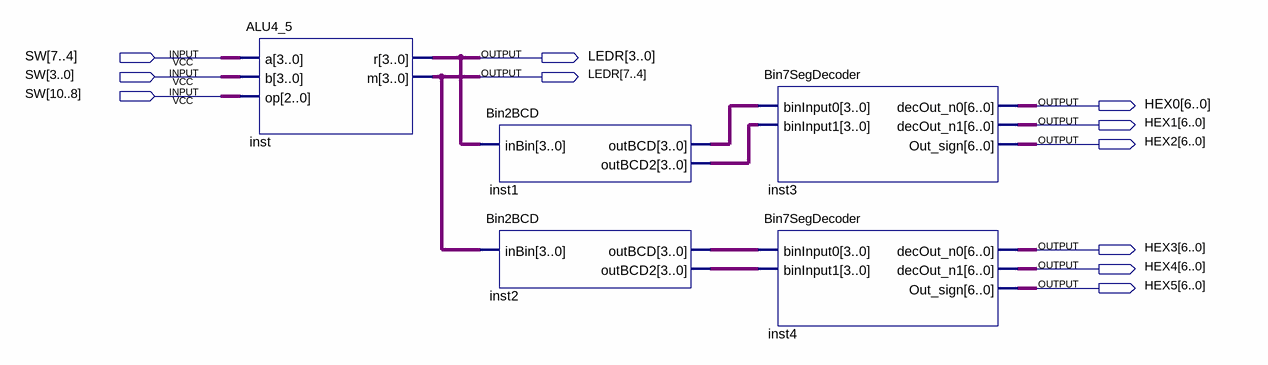
[diagram p0: schematic sheet]
// Quartus schematic ALU_5.bdf as structural Verilog: 5 symbols, 11 pins
module ALU_5 (
  input  [10:0] SW,
  output [7:0] LEDR,
  output [6:0] HEX0,
  output [6:0] HEX1,
  output [6:0] HEX2,
  output [6:0] HEX3,
  output [6:0] HEX4,
  output [6:0] HEX5
);

  wire [3:0] inst1_outbcd, inst1_outbcd2, inst2_outbcd, inst2_outbcd2;

  ALU4_5 inst (.a(SW[7:4]), .b(SW[3:0]), .op(SW[10:8]), .r(LEDR[3:0]), .m(LEDR[7:4]));
  Bin2BCD inst1 (.inBin(LEDR[3:0]), .outBCD(inst1_outbcd), .outBCD2(inst1_outbcd2));
  Bin2BCD inst2 (.inBin(LEDR[7:4]), .outBCD(inst2_outbcd), .outBCD2(inst2_outbcd2));
  Bin7SegDecoder inst3 (
    .binInput0(inst1_outbcd), .binInput1(inst1_outbcd2), .decOut_n0(HEX0), .decOut_n1(HEX1), .Out_sign(HEX2));
  Bin7SegDecoder inst4 (
    .binInput0(inst2_outbcd), .binInput1(inst2_outbcd2), .decOut_n0(HEX3), .decOut_n1(HEX4), .Out_sign(HEX5));
endmodule
